# EAGLE schematic bmsmot (EAGLE 4.13)

## Sheet 1 of 2
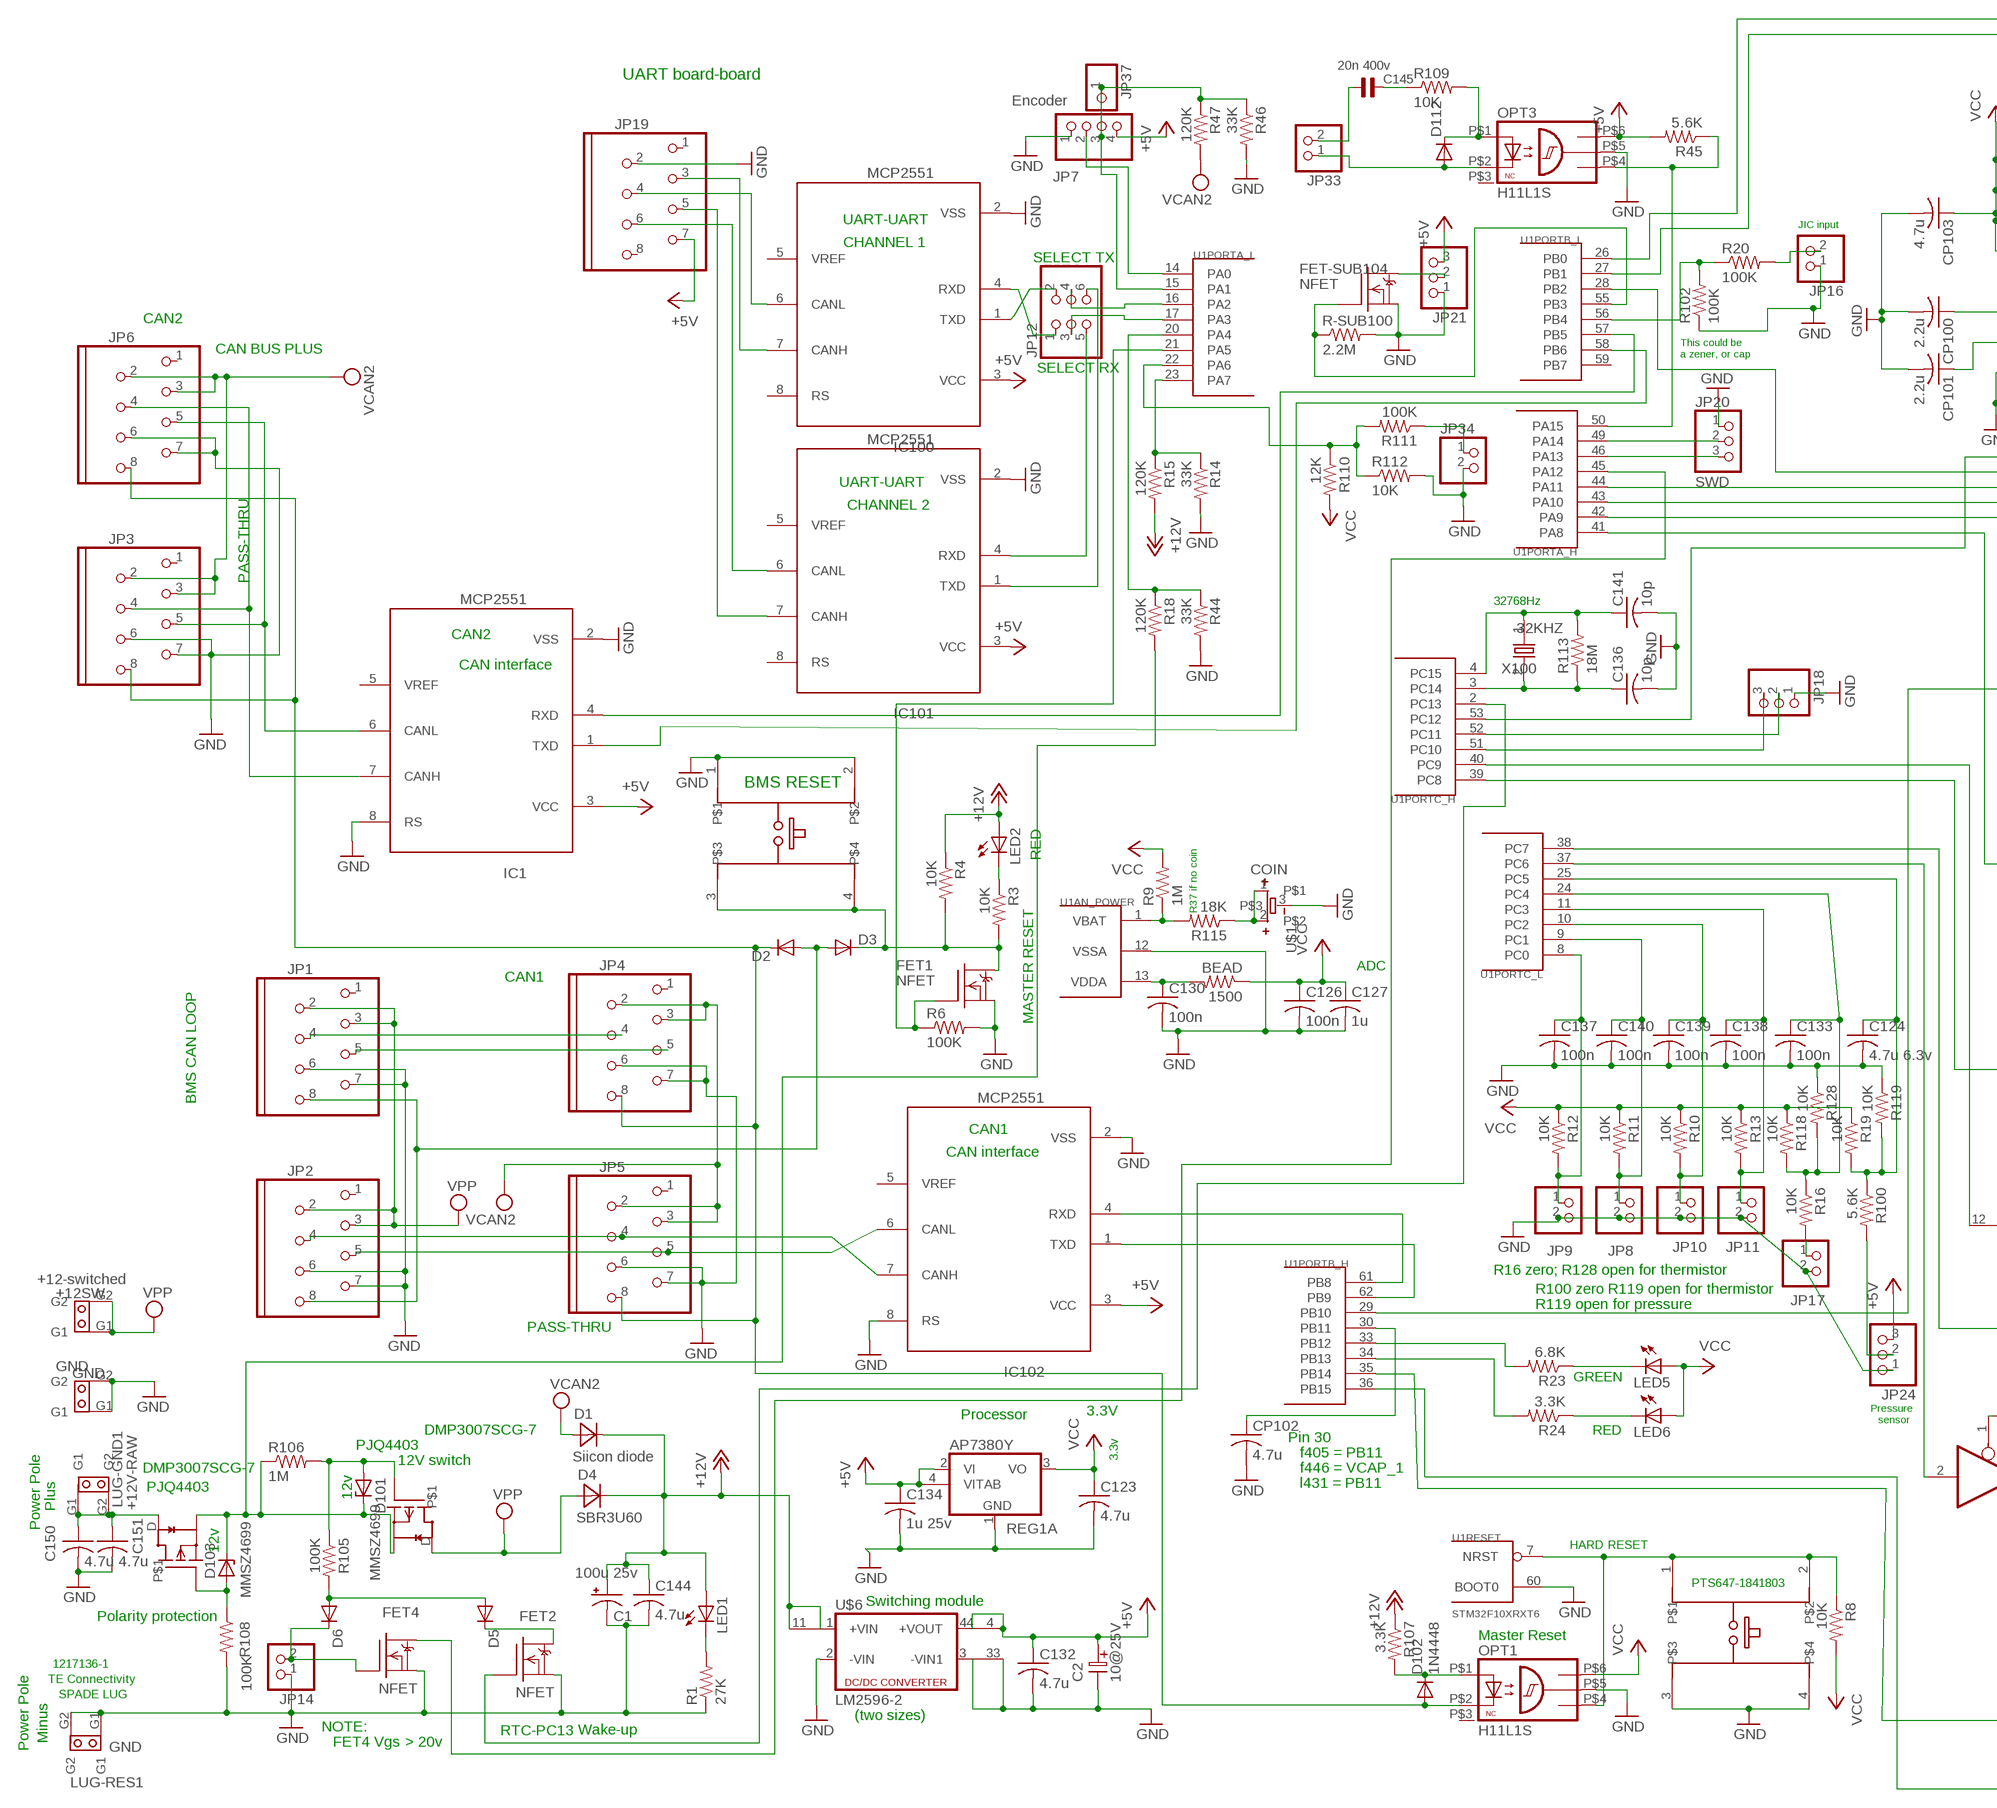
[diagram p0: schematic, sheet 1, part 1 of 2]
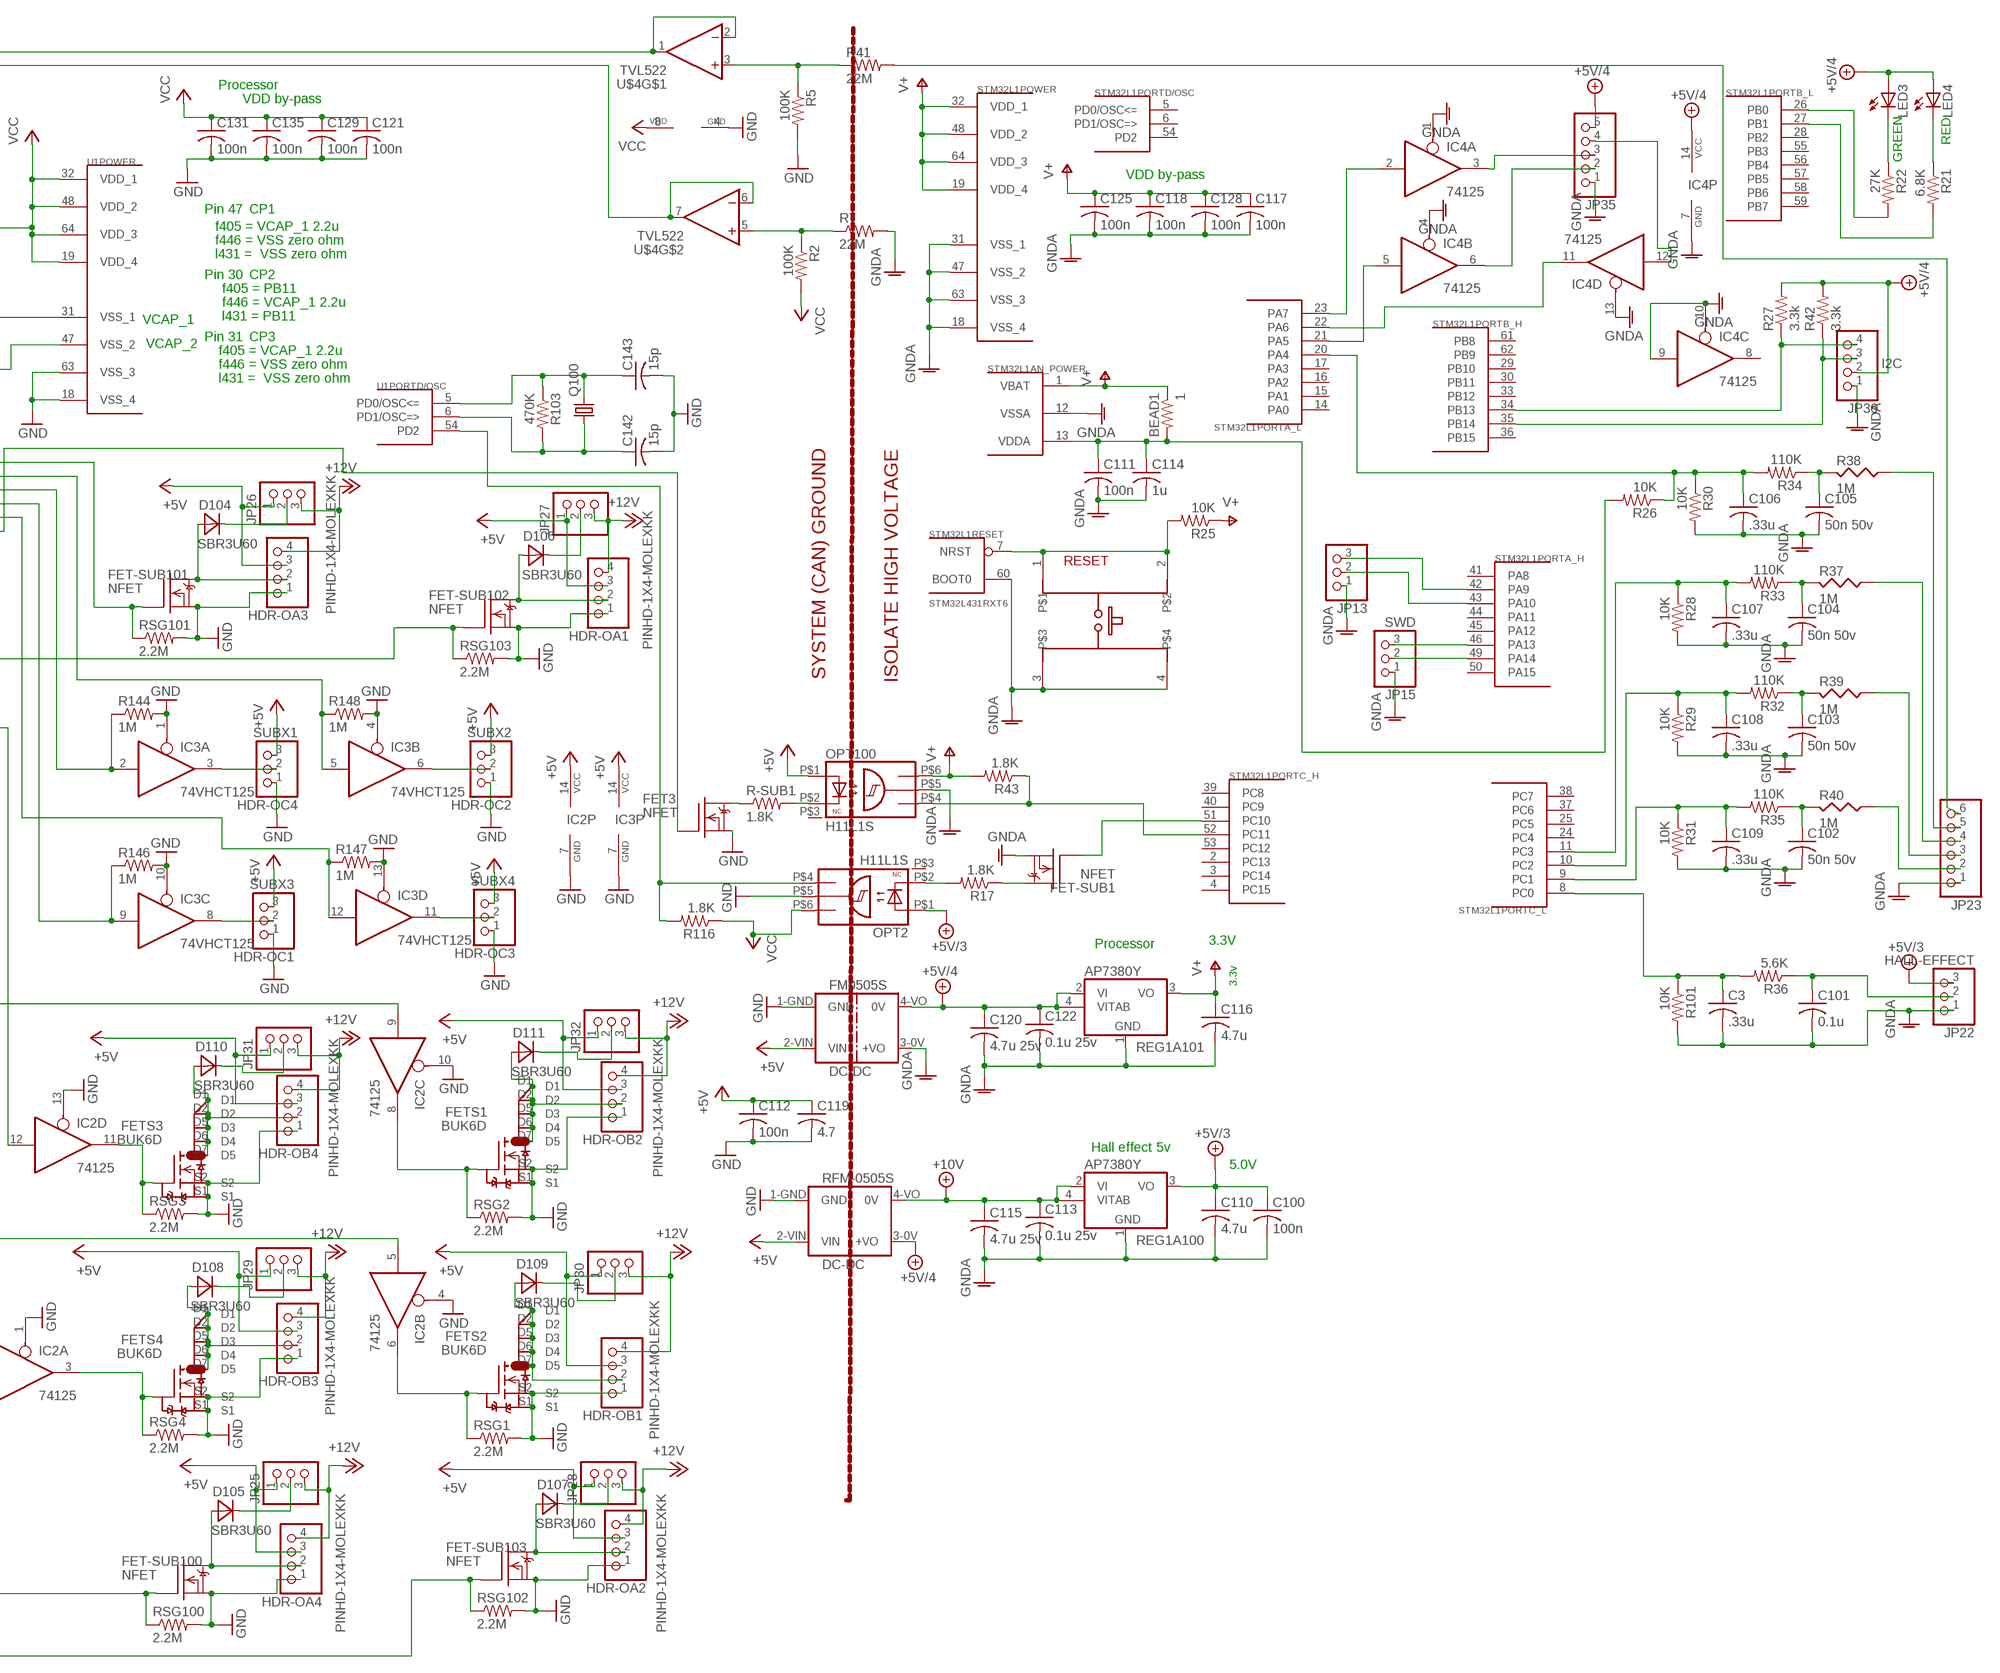
[diagram p1: schematic, sheet 1, part 2 of 2]

### Parts
32KHZ  X100  XTAL32KX32  [32KHZ]
+12SW  +12-switched  SPADE-TAB  [SPADE_TAB]
BEAD  1500  R-US_R0603  [R0603]
BEAD1  1  R-US_R0603  [R0603]
BMS-RESET  E-SWITCH2  [E-SWITCH2]
C1  100u 25v  CPOL-USE5-8.5  [E5-8,5]
C2  10@25V  ELC-2,5L  [ES-2,5L]
C3  .33u  C-USC0603  [C0603]
C100  100n  C-USC0603  [C0603]
C101  0.1u  C-USC0603  [C0603]
C102  50n 50v  C-USC0603  [C0603]
C103  50n 50v  C-USC0603  [C0603]
C104  50n 50v  C-USC0603  [C0603]
C105  50n 50v  C-USC0603  [C0603]
C106  .33u  C-USC0603  [C0603]
C107  .33u  C-USC0603  [C0603]
C108  .33u  C-USC0603  [C0603]
C109  .33u  C-USC0603  [C0603]
C110  4.7u  C-USC0603  [C0603]
C111  100n  C-USC0603  [C0603]
C112  100n  C-USC0603  [C0603]
C113  0.1u 25v  C-USC0603  [C0603]
C114  1u  C-USC0603  [C0603]
C115  4.7u 25v  C-USC0805  [C0805]
C116  4.7u  C-USC0603  [C0603]
C117  100n  C-USC0603  [C0603]
C118  100n  C-USC0603  [C0603]
C119  4.7  C-USC0805  [C0805]
C120  4.7u 25v  C-USC0805  [C0805]
C121  100n  C-USC0603  [C0603]
C122  0.1u 25v  C-USC0603  [C0603]
C123  4.7u  C-USC0603  [C0603]
C124  4.7u 6.3v  C-USC0603  [C0603]
C125  100n  C-USC0603  [C0603]
C126  100n  C-USC0603  [C0603]
C127  1u  C-USC0603  [C0603]
C128  100n  C-USC0603  [C0603]
C129  100n  C-USC0603  [C0603]
C130  100n  C-USC0603  [C0603]
C131  100n  C-USC0603  [C0603]
C132  4.7u  C-USC0603  [C0603]
C133  100n  C-USC0603  [C0603]
C134  1u 25v  C-USC0603  [C0603]
C135  100n  C-USC0603  [C0603]
C136  10p  C-USC0603  [C0603]
C137  100n  C-USC0603  [C0603]
C138  100n  C-USC0603  [C0603]
C139  100n  C-USC0603  [C0603]
C140  100n  C-USC0603  [C0603]
C141  10p  C-USC0603  [C0603]
C142  15p  C-USC0603  [C0603]
C143  15p  C-USC0603  [C0603]
C144  4.7u  C-USC0805  [C0805]
C145  20n 400v  C1210  [1210]
C150  4.7u  C-USC0805  [C0805]
C151  4.7u  C-USC0805  [C0805]
CP100  2.2u  C-USC0603  [C0603]
CP101  2.2u  C-USC0603  [C0603]
CP102  4.7u  C-USC0603  [C0603]
CP103  4.7u  C-USC0603  [C0603]
D1  Siicon diode  SBR3U60  [POWERDI123]
D2  DIODE-SOD323-R  [SOD323-R]
D3  DIODE-SOD323-R  [SOD323-R]
D4  SBR3U60  [POWERDI123]
D5  DIODE-SOD323-R  [SOD323-R]
D6  DIODE-SOD323-R  [SOD323-R]
D101  MMSZ4699  ZENER-DIODESOD80C  [SOD80C]
D102  1N4448  DIODE-SOD123  [SOD123]
D103  MMSZ4699  ZENER-DIODESOD80C  [SOD80C]
D104  SBR3U60  [POWERDI123]
D105  SBR3U60  [POWERDI123]
D106  SBR3U60  [POWERDI123]
D107  SBR3U60  [POWERDI123]
D108  SBR3U60  [POWERDI123]
D109  SBR3U60  [POWERDI123]
D110  SBR3U60  [POWERDI123]
D111  SBR3U60  [POWERDI123]
D112  DIODE-SOD323-R  [SOD323-R]
FET1  NFET  DMN3404L  [SOT-23]
FET2  NFET  DMN3404L  [SOT-23]
FET3  NFET  DMN3404L  [SOT-23]
FET4  NFET  DMN3404L  [SOT-23]
FET-SUB1  NFET  DMN3404L  [SOT-23]
FET-SUB100  NFET  DMN3404L  [SOT-23]
FET-SUB101  NFET  DMN3404L  [SOT-23]
FET-SUB102  NFET  DMN3404L  [SOT-23]
FET-SUB103  NFET  DMN3404L  [SOT-23]
FET-SUB104  NFET  DMN3404L  [SOT-23]
FETS1  BUK6D  [DFN2020-6]
FETS2  BUK6D  [DFN2020-6]
FETS3  BUK6D  [DFN2020-6]
FETS4  BUK6D  [DFN2020-6]
FM0505S  DC-DC  [DC-DC]
GND  GND  SPADE-TAB  [SPADE_TAB]
HDR-OA1  PINHD-1X4-MOLEXKK  [1X4-MOLEXKK]
HDR-OA2  PINHD-1X4-MOLEXKK  [1X4-MOLEXKK]
HDR-OA3  PINHD-1X4-MOLEXKK  [1X4-MOLEXKK]
HDR-OA4  PINHD-1X4-MOLEXKK  [1X4-MOLEXKK]
HDR-OB1  PINHD-1X4-MOLEXKK  [1X4-MOLEXKK]
HDR-OB2  PINHD-1X4-MOLEXKK  [1X4-MOLEXKK]
HDR-OB3  PINHD-1X4-MOLEXKK  [1X4-MOLEXKK]
HDR-OB4  PINHD-1X4-MOLEXKK  [1X4-MOLEXKK]
HDR-OC1  SUBX3  PINHD-1X3  [1X03]
HDR-OC2  SUBX2  PINHD-1X3  [1X03]
HDR-OC3  SUBX4  PINHD-1X3  [1X03]
HDR-OC4  SUBX1  PINHD-1X3  [1X03]
IC1  MCP2551  [SO-08]
IC2  74125  [TSSOP14]
IC3  74VHCT125  74125  [TSSOP14]
IC4  74125  [TSSOP14]
IC100  MCP2551  [SO-08]
IC101  MCP2551  [SO-08]
IC102  MCP2551  [SO-08]
JP1  MOD8P8C  [MOD8P8C]
JP2  MOD8P8C  [MOD8P8C]
JP3  MOD8P8C  [MOD8P8C]
JP4  MOD8P8C  [MOD8P8C]
JP5  MOD8P8C  [MOD8P8C]
JP6  MOD8P8C  [MOD8P8C]
JP7  Encoder  PINHD-1X4  [1X04]
JP8  PINHD-1X2  [1X02]
JP9  PINHD-1X2  [1X02]
JP10  PINHD-1X2  [1X02]
JP11  PINHD-1X2  [1X02]
JP12  PINHD-2X3  [2X03]
JP13  PINHD-1X3  [1X03]
JP14  PINHD-1X2  [1X02]
JP15  SWD  PINHD-1X3  [1X03]
JP16  PINHD-1X2  [1X02]
JP17  PINHD-1X2  [1X02]
JP18  PINHD-1X3  [1X03]
JP19  MOD8P8C  [MOD8P8C]
JP20  SWD  PINHD-1X3  [1X03]
JP21  PINHD-1X3  [1X03]
JP22  HALL-EFFECT  PINHD-1X3  [1X03]
JP23  PINHD-1X6  [1X06]
JP24  PINHD-1X3  [1X03]
JP25  PINHD-1X3  [1X03]
JP26  PINHD-1X3  [1X03]
JP27  PINHD-1X3  [1X03]
JP28  PINHD-1X3  [1X03]
JP29  PINHD-1X3  [1X03]
JP30  PINHD-1X3  [1X03]
JP31  PINHD-1X3  [1X03]
JP32  PINHD-1X3  [1X03]
JP33  PINHD-1X2  [1X02]
JP34  PINHD-1X2  [1X02]
JP35  PINHD-1X5  [1X05]
JP36  I2C  PINHD-1X4  [1X04]
JP37  PINHD-1X1  [1X01]
LED1  LEDCHIP-LED0603  [CHIP-LED0603]
LED2  LEDCHIP-LED0603  [CHIP-LED0603]
LED3  LEDCHIP-LED0603  [CHIP-LED0603]
LED4  LEDCHIP-LED0603  [CHIP-LED0603]
LED5  LEDCHIP-LED0603  [CHIP-LED0603]
LED6  LEDCHIP-LED0603  [CHIP-LED0603]
LUG-GND1  +12V-RAW  SPADE-TAB  [SPADE_TAB]
LUG-RES1  GND  SPADE-TAB  [SPADE_TAB]
OPT1  H11L1S  H!!LX  [SMD-6]
OPT2  H11L1S  H!!LX  [SMD-6]
OPT3  H11L1S  H!!LX  [SMD-6]
OPT100  H11L1S  H!!LX  [SMD-6]
Q100  CRYTALHC49S  [HC49/S]
R1  27K  R-US_R0603  [R0603]
R2  100K  R-US_R0603  [R0603]
R3  10K  R-US_R0603  [R0603]
R4  10K  R-US_R0603  [R0603]
R5  100K  R-US_R0603  [R0603]
R6  100K  R-US_R0603  [R0603]
R7  22M  R-US_0207/5V  [0207/5V]
R8  10K  R-US_R0603  [R0603]
R9  1M  R-US_R0603  [R0603]
R10  10K  R-US_R0603  [R0603]
R11  10K  R-US_R0603  [R0603]
R12  10K  R-US_R0603  [R0603]
R13  10K  R-US_R0603  [R0603]
R14  33K  R-US_R0603  [R0603]
R15  120K  R-US_R0603  [R0603]
R16  10K  R-US_R0603  [R0603]
R17  1.8K  R-US_R0603  [R0603]
R18  120K  R-US_R0603  [R0603]
R19  10K  R-US_R0603  [R0603]
R20  100K  R-US_R0603  [R0603]
R21  6.8K  R-US_R0603  [R0603]
R22  27K  R-US_R0603  [R0603]
R23  6.8K  R-US_R0603  [R0603]
R24  3.3K  R-US_R0603  [R0603]
R25  10K  R-US_R0603  [R0603]
R26  10K  R-US_R0603  [R0603]
R27  3.3k  R-US_R0603  [R0603]
R28  10K  R-US_R0603  [R0603]
R29  10K  R-US_R0603  [R0603]
R30  10K  R-US_R0603  [R0603]
R31  10K  R-US_R0603  [R0603]
R32  110K  R-US_R0603  [R0603]
R33  110K  R-US_R0603  [R0603]
R34  110K  R-US_R0603  [R0603]
R35  110K  R-US_R0603  [R0603]
R36  5.6K  R-US_R0603  [R0603]
R37  1M  RESUS-S2,5  [RS-2,5]
R38  1M  RESUS-S2,5  [RS-2,5]
R39  1M  RESUS-S2,5  [RS-2,5]
R40  1M  RESUS-S2,5  [RS-2,5]
R41  22M  R-US_0207/5V  [0207/5V]
R42  3.3k  R-US_R0603  [R0603]
R43  1.8K  R-US_R0603  [R0603]
R44  33K  R-US_R0603  [R0603]
R45  5.6K  R-US_R0603  [R0603]
R46  33K  R-US_R0603  [R0603]
R47  120K  R-US_R0603  [R0603]
R100  5.6K  R-US_R0603  [R0603]
R101  10K  R-US_R0603  [R0603]
R102  100K  R-US_R0603  [R0603]
R103  470K  R-US_R0603  [R0603]
R105  100K  R-US_R0603  [R0603]
R106  1M  R-US_R0603  [R0603]
R107  3.3K  R-US_R0603  [R0603]
R108  100K  R-US_R0603  [R0603]
R109  10K  R-US_R0603  [R0603]
R110  12K  R-US_R0603  [R0603]
R111  100K  R-US_R0603  [R0603]
R112  10K  R-US_R0603  [R0603]
R113  18M  R-US_R0603  [R0603]
R115  18K  R-US_R0603  [R0603]
R116  1.8K  R-US_R0603  [R0603]
R118  10K  R-US_R0603  [R0603]
R119  10K  R-US_R0603  [R0603]
R128  10K  R-US_R0603  [R0603]
R144  1M  R-US_R0402  [R0402]
R146  1M  R-US_R0402  [R0402]
R147  1M  R-US_R0402  [R0402]
R148  1M  R-US_R0402  [R0402]
R-SUB1  1.8K  R-US_R0603  [R0603]
R-SUB100  2.2M  R-US_R0603  [R0603]
REG1A  AP7380Y  [SOT89]
REG1A100  AP7380Y  [SOT89]
REG1A101  AP7380Y  [SOT89]
RESET  E-SWITCH2  [E-SWITCH2]
RESET1  E-SWITCH2  [E-SWITCH2]
RFM-0505S  DC-DC  [DC-DC]
RSG1  2.2M  R-US_R0603  [R0603]
RSG2  2.2M  R-US_R0603  [R0603]
RSG3  2.2M  R-US_R0603  [R0603]
RSG4  2.2M  R-US_R0603  [R0603]
RSG100  2.2M  R-US_R0603  [R0603]
RSG101  2.2M  R-US_R0603  [R0603]
RSG102  2.2M  R-US_R0603  [R0603]
RSG103  2.2M  R-US_R0603  [R0603]
STM32L1  STM32L431RXT6  STM32F10XRXT6  [TQFP64]
U1  STM32F10XRXT6  [TQFP64]
U$1  COIN  [COIN]
U$2  PJQ4403P  [DFN3333-8L]
U$3  PJQ4403P  [DFN3333-8L]
U$4  TVL522  [VSSOP8]
U$6  LM2596-2  [LM2569SW2]

### Nets
+5V: C2.1 C112.1 C119.1 C132.1 C134.1 FM0505S.2-VIN(VIN) HDR-OA1.3 HDR-OA2.3 HDR-OA3.3 HDR-OA4.3 HDR-OB1.3 HDR-OB2.3 HDR-OB3.3 HDR-OB4.3 HDR-OC1.3 HDR-OC2.3 HDR-OC3.3 HDR-OC4.3 IC1.3(VCC) IC2.14(P:VCC) IC3.14(P:VCC) IC100.3(VCC) IC101.3(VCC) IC102.3(VCC) JP7.4 JP19.7 JP21.3 JP24.3 JP25.1 JP26.1 JP27.1 JP28.1 JP29.1 JP30.1 JP31.1 JP32.1 OPT3.P$6(VCC) OPT100.P$1(A) R45.2 REG1A.2(VI) REG1A.4(VITAB) RFM-0505S.2-VIN(VIN) U$6.4(+VOUT1) U$6.44(+VOUT)
+5V/3: C100.1 C110.1 JP22.3 OPT2.P$1(A) REG1A100.3(VO)
+5V/4: C120.1 C122.1 FM0505S.4-VO(0V) IC4.14(P:VCC) JP35.5 JP36.2 LED3.A LED4.A R27.2 R42.2 REG1A101.2(VI) REG1A101.4(VITAB) RFM-0505S.3-0V(+VO)
+10V: C113.1 C115.1 REG1A100.2(VI) REG1A100.4(VITAB) RFM-0505S.4-VO(0V)
+12V: C1.+ C144.1 D1.C D4.C HDR-OA1.4 HDR-OA2.4 HDR-OA3.4 HDR-OA4.4 HDR-OB1.4 HDR-OB2.4 HDR-OB3.4 HDR-OB4.4 JP25.3 JP26.3 JP27.3 JP28.3 JP29.3 JP30.3 JP31.3 JP32.3 LED1.A LED2.A R4.1 R15.2 R107.1 U$6.1(+VIN) U$6.11(+VIN1)
+12V-POLARITY: D101.C D103.C R18.2 R106.1 U$2.S(S3) U$3.S(S3)
+12V-RAW: C150.1 C151.1 LUG-GND1.G1 LUG-GND1.G2 U$2.D
AC-12VRMS: JP34.1 R111.1
AC-OPTO-1: D112.A JP33.1 OPT3.P$2(C)
AC-OPTO-2: C145.1 JP33.2
AC-OPTO-IN: D112.C OPT3.P$1(A) R109.2
AC-OPTO-RC: C145.2 R109.1
BUFF1-PC8: IC2.9(C:I) U1.39(PORTC_H:PC8)
BUFF2-PC7: IC2.5(B:I) U1.38(PORTC_L:PC7)
BUFF5-PC9: IC2.12(D:I) U1.40(PORTC_H:PC9)
BUFF6-PC6: IC2.2(A:I) U1.37(PORTC_L:PC6)
CANH1: IC102.7(CANH) JP2.4 JP5.4
CANH1-FT: JP1.4 JP4.4
CANH2: IC1.7(CANH) JP3.4 JP6.4
CANL1: IC102.6(CANL) JP2.5 JP5.5
CANL1-FT: JP1.5 JP4.5
CANL2: IC1.6(CANL) JP3.5 JP6.5
CHAN1-RX: IC100.4(RXD) JP12.1
CHAN1-TX: IC100.1(TXD) JP12.2
CHAN1_CAN-L: IC100.6(CANL) JP19.4
CHAN2-RX: IC101.4(RXD) JP12.5
CHAN2-TX: IC101.1(TXD) JP12.6
CHAN2_CAN-H: IC101.7(CANH) JP19.5
CHAN2_CAN-L: IC101.6(CANL) JP19.6
CHAN-1_CAN-H: IC100.7(CANH) JP19.3
COIN+: R115.1 U$1.1 U$1.2
DRAIN-SUB1: D111.A FETS1.D1 FETS1.D2 FETS1.D5(D3) FETS1.D6(D4) FETS1.D7(D5) HDR-OB2.2
DRAIN-SUB2: D109.A FETS2.D1 FETS2.D2 FETS2.D5(D3) FETS2.D6(D4) FETS2.D7(D5) HDR-OB1.2
DRAIN-SUB5: D110.A FETS3.D1 FETS3.D2 FETS3.D5(D3) FETS3.D6(D4) FETS3.D7(D5) HDR-OB4.2
DRAIN-SUB6: D108.A FETS4.D1 FETS4.D2 FETS4.D5(D3) FETS4.D6(D4) FETS4.D7(D5) HDR-OB3.2
DRAIN-SUB13: D107.A FET-SUB103.3(D) HDR-OA2.2
DRAIN-SUB14: D106.A FET-SUB102.3(D) HDR-OA1.2
DRAIN-SUB17: D104.A FET-SUB101.3(D) HDR-OA3.2
DRAIN-SUB18: D105.A FET-SUB100.3(D) HDR-OA4.2
DSEL-OA1: D106.C JP27.2
DSEL-OA2: D107.C JP28.2
DSEL-OA3: D104.C JP26.2
DSEL-OA4: D105.C JP25.2
DSEL-OB1: D109.C JP30.2
DSEL-OB2: D111.C JP32.2
DSEL-OB3: D108.C JP29.2
DSEL-OB4: D110.C JP31.2
FET1-DRAIN-MASTER-RESET: BMS-RESET.3 BMS-RESET.4 D3.C FET1.3(D) R3.2 R4.2
FET2-DRAIN: D5.C FET2.3(D)
FET3-DRAIN-UART5-TX: FET3.3(D) R-SUB1.1
FET103-GATE: D103.A R108.1 U$2.G
FET-SUB9-DRAIN: FET-SUB104.3(D) JP21.2
GATE-SUB4-PB10: FET-SUB102.1(G) RSG103.1 U1.29(PORTB_H:PB10)
GATE-SUB7-PB2: FET-SUB101.1(G) RSG101.1 U1.28(PORTB_L:PB2)
GATE-SUBH3-PB15: FET-SUB103.1(G) RSG102.1 U1.36(PORTB_H:PB15)
GATE-SUBH8-PB14: FET-SUB100.1(G) RSG100.1 U1.35(PORTB_H:PB14)
GND: BMS-RESET.1 BMS-RESET.2 C1.- C2.2 C112.2 C119.2 C121.2 C123.2 C124.2 C126.2 C127.2 C129.2 C130.2 C131.2 C132.2 C133.2 C134.2 C135.2 C136.2 C137.2 C138.2 C139.2 C140.2 C141.2 C142.2 C143.2 C144.2 C150.2 C151.2 CP100.2 CP101.2 CP102.2 CP103.2 FET1.2(S) FET2.2(S) FET3.2(S) FET4.2(S) FET-SUB100.2(S) FET-SUB101.2(S) FET-SUB102.2(S) FET-SUB103.2(S) FET-SUB104.2(S) FETS1.S1 FETS1.S2 FETS2.S1 FETS2.S2 FETS3.S1 FETS3.S2 FETS4.S1 FETS4.S2 FM0505S.1-GND(GND) GND.G1 GND.G2 HDR-OA1.1 HDR-OA2.1 HDR-OA3.1 HDR-OA4.1 HDR-OB1.1 HDR-OB2.1 HDR-OB3.1 HDR-OB4.1 HDR-OC1.1 HDR-OC2.1 HDR-OC3.1 HDR-OC4.1 IC1.2(VSS) IC1.8(RS) IC2.1(A:OE) IC2.4(B:OE) IC2.7(P:GND) IC2.10(C:OE) IC2.13(D:OE) IC3.1(A:OE) IC3.4(B:OE) IC3.7(P:GND) IC3.10(C:OE) IC3.13(D:OE) IC100.2(VSS) IC101.2(VSS) IC102.2(VSS) IC102.8(RS) JP1.6 JP1.7 JP2.6 JP2.7 JP3.6 JP3.7 JP4.6 JP4.7 JP5.6 JP5.7 JP6.6 JP6.7 JP7.1 JP8.2 JP9.2 JP10.2 JP11.2 JP14.1 JP16.1 JP17.2 JP18.1 JP19.2 JP20.1 JP21.1 JP24.1 JP34.2 LUG-RES1.G1 LUG-RES1.G2 OPT1.P$5(GND) OPT2.P$5(GND) OPT3.P$5(GND) R1.1 R5.2 R6.2 R14.2 R44.2 R46.2 R102.1 R108.2 R112.2 R119.1 R128.1 R144.2 R146.2 R147.2 R148.2 R-SUB100.2 REG1A.1(GND) RESET.3 RESET.4 RFM-0505S.1-GND(GND) RSG1.2 RSG2.2 RSG3.2 RSG4.2 RSG100.2 RSG101.2 RSG102.2 RSG103.2 U1.12(AN_POWER:VSSA) U1.18(POWER:VSS_4) U1.60(RESET:BOOT0) U1.63(POWER:VSS_3) U$1.3 U$4.4(GND) U$6.2(-VIN) U$6.3(-VIN1) U$6.33(-VIN2)
GNDA: C3.2 C100.2 C101.2 C102.2 C103.2 C104.2 C105.2 C106.2 C107.2 C108.2 C109.2 C110.2 C111.2 C113.2 C114.2 C115.2 C116.2 C117.2 C118.2 C120.2 C122.2 C125.2 C128.2 FET-SUB1.2(S) FM0505S.3-0V(+VO) IC4.1(A:OE) IC4.4(B:OE) IC4.7(P:GND) IC4.9(C:I) IC4.10(C:OE) IC4.13(D:OE) JP13.1 JP15.1 JP22.1 JP23.1 JP35.1 JP36.1 OPT100.P$5(GND) R7.2 R28.2 R29.2 R30.2 R31.2 R101.2 REG1A100.1(GND) REG1A101.1(GND) RESET1.3 RESET1.4 STM32L1.12(AN_POWER:VSSA) STM32L1.18(POWER:VSS_4) STM32L1.31(POWER:VSS_1) STM32L1.47(POWER:VSS_2) STM32L1.60(RESET:BOOT0) STM32L1.63(POWER:VSS_3)
HDRXA1: HDR-OC1.2 IC3.8(C:O)
HDRXA2: HDR-OC2.2 IC3.6(B:O)
HDRXA3: HDR-OC3.2 IC3.11(D:O)
HDRXA4: HDR-OC4.2 IC3.3(A:O)
HV1: JP23.4 R37.1
HV1-1: C104.1 R33.1 R37.2
HV1-2: C103.1 R32.1 R39.2
HV1-3: C102.1 R35.1 R40.2
HV1-4: C105.1 R34.1 R38.2
HV2: JP23.3 R39.1
HV3: JP23.2 R40.1
HV-AC: JP23.5 R38.1
HV-HALL-SIGNAL: C101.1 JP22.2 R36.1
HV-PLUS: JP23.6 R41.2
HV_LEAK-: R2.1 R7.1 U$4.5(+IN)
HV_LEAK_DIV+: R5.1 R41.1 U$4.3(+IN)
JIC-INPUT: JP16.2 R20.2
JP17-PC4: JP17.1 R16.2
JP24-PC5: JP24.2 R100.2
L431-LED-GRN-CATHODE: LED3.C R22.1
L431-LED-RED-CATHODE: LED4.C R21.1
L431-PA13-SWDIO: JP15.3 STM32L1.46(PORTA_H:PA13)
L431-PA14-SWCLK: JP15.2 STM32L1.49(PORTA_H:PA14)
L431-PB0-LED-GRN: R22.2 STM32L1.26(PORTB_L:PB0)
L431-PB1-LED-RED: R21.2 STM32L1.27(PORTB_L:PB1)
L431-PC10-USART3-TX2: FET-SUB1.1(G) STM32L1.51(PORTC_H:PC10)
L431-PC11-USART3-RX: OPT100.P$4(OUT) R43.1 STM32L1.52(PORTC_H:PC11)
L431-UART-TX-FET: FET-SUB1.3(D) R17.1
L431-USART-TX-OPTO: OPT2.P$2(C) R17.2
L431-VDDA: BEAD1.2 C111.1 C114.1 R26.2 STM32L1.13(AN_POWER:VDDA)
L-I2C2-SDA: JP36.4 R27.1 STM32L1.34(PORTB_H:PB13)
L-PA5-SPI1-SCK: IC4.5(B:I) STM32L1.21(PORTA_L:PA5)
L-PA6-SPI1-MISO: IC4.11(D:O) STM32L1.22(PORTA_L:PA6)
L-PA7-SPI1-MOSI: IC4.2(A:I) STM32L1.23(PORTA_L:PA7)
L-PB14-I2C2-SDA: JP36.3 R42.1 STM32L1.35(PORTB_H:PB14)
L-SPI1-MISO: IC4.12(D:I) JP35.4
L-SPI1-MOSI: IC4.3(A:O) JP35.3
L-SPI1-SCK: IC4.6(B:O) JP35.2
LED-EXT-GRN-CATHODE: LED5.C R23.1
LED-EXT-RED-CATHODE: LED6.C R24.1
LED-EXT-RED-CATHODE2: LED2.C R3.1
LED_BUS_PWR: LED1.C R1.2
MASTER-RESET-RESISTOR: D102.C OPT1.P$1(A) R107.2
MASTER-RESET-SYS: D2.C D102.A JP3.8 JP4.8 JP5.8 JP6.8 OPT1.P$2(C)
MASTER_RESET1: D2.A D3.A JP1.8 JP2.8
N$1: D6.C FET4.1(G) JP14.2
NRST: OPT1.P$4(OUT) R8.1 RESET.1 RESET.2 U1.7(RESET:NRST)
NRST1: R25.2 RESET1.1 RESET1.2 STM32L1.7(RESET:NRST)
PA0-T2C1: JP7.2 U1.14(PORTA_L:PA0)
PA1-T2C2|SYS12V: JP7.3 JP37.1 R46.1 R47.1 U1.15(PORTA_L:PA1)
PA2-USART2-TX: JP12.4 U1.16(PORTA_L:PA2)
PA3-USART2-RX: JP12.3 U1.17(PORTA_L:PA3)
PA4-RSP12V_POLARITY: R18.1 R44.1 U1.20(PORTA_L:PA4)
PA5-MASTER-RESET: FET1.1(G) R6.1 U1.21(PORTA_L:PA5)
PA6: R110.1 R111.2 R112.1 U1.22(PORTA_L:PA6)
PA7-12V-PROTECT-DIVIDER: R14.1 R15.1 U1.23(PORTA_L:PA7)
PA8-HDRX3: IC3.12(D:I) R147.1 U1.41(PORTA_H:PA8)
PA9-HDRX1: IC3.9(C:I) R146.1 U1.42(PORTA_H:PA9)
PA9-USART1-TX: JP13.3 STM32L1.42(PORTA_H:PA9)
PA10-HDRX4: IC3.2(A:I) R144.1 U1.43(PORTA_H:PA10)
PA10-USART1-RX: JP13.2 STM32L1.43(PORTA_H:PA10)
PA11-HDRX2: IC3.5(B:I) R148.1 U1.44(PORTA_H:PA11)
PA12-KEYSW-SENSE: FET4.3(D) U1.45(PORTA_H:PA12)
PA13-SWDIO: JP20.3 U1.46(PORTA_H:PA13)
PA14-SWCLK: JP20.2 U1.49(PORTA_H:PA14)
PA15-OPTO-OUT: OPT3.P$4(OUT) R45.1 U1.50(PORTA_H:PA15)
PB0_HVLEAK+: U1.26(PORTB_L:PB0) U$4.1(OUT) U$4.2(-IN)
PB1-HV_LEAK-: U1.27(PORTB_L:PB1) U$4.6(-IN) U$4.7(OUT)
PB3-SUB9: FET-SUB104.1(G) R-SUB100.1 U1.55(PORTB_L:PB3)
PB4: R20.1 R102.2 U1.56(PORTB_L:PB4)
PB5-CAN2-RX: IC1.4(RXD) U1.57(PORTB_L:PB5)
PB6-CAN2-TX: IC1.1(TXD) U1.58(PORTB_L:PB6)
PB8-CAN1-RX: IC102.4(RXD) U1.61(PORTB_H:PB8)
PB9-CAN1-TX: IC102.1(TXD) U1.62(PORTB_H:PB9)
PB11-I2C2-SDA|VCAP1: CP102.1 U1.30(PORTB_H:PB11)
PB12-LED2-GREEN: R23.2 U1.33(PORTB_H:PB12)
PB13-LED3-RED: R24.2 U1.34(PORTB_H:PB13)
PC0-ADC1_IN1: C3.1 R36.2 R101.1 STM32L1.8(PORTC_L:PC0)
PC0-IN10: C137.1 JP9.1 R12.2 U1.8(PORTC_L:PC0)
PC1-ADC1_IN2: C109.1 R31.1 R35.2 STM32L1.9(PORTC_L:PC1)
PC1-IN11: C140.1 JP8.1 R11.2 U1.9(PORTC_L:PC1)
PC2-ADC1-IN3: C108.1 R29.1 R32.2 STM32L1.10(PORTC_L:PC2)
PC2-IN12: C139.1 JP10.1 R10.2 U1.10(PORTC_L:PC2)
PC3-ADC1-IN4: C107.1 R28.1 R33.2 STM32L1.11(PORTC_L:PC3)
PC3-IN13: C138.1 JP11.1 R13.2 U1.11(PORTC_L:PC3)
PC4-ADC1_IN9: C106.1 R26.1 R30.1 R34.2 STM32L1.20(PORTA_L:PA4)
PC4-IN14: C133.1 R16.1 R118.2 R128.2 U1.24(PORTC_L:PC4)
PC5-IN15: C124.1 R19.2 R100.1 R119.2 U1.25(PORTC_L:PC5)
PC10-USART3-TX: JP18.3 U1.51(PORTC_H:PC10)
PC11-USART3-RX: JP18.2 U1.52(PORTC_H:PC11)
PC12-UART5-TX: FET3.1(G) U1.53(PORTC_H:PC12)
PC13-NFET-GATE: FET2.1(G) U1.2(PORTC_H:PC13)
PC14_OSC32IN|XTAL: 32KHZ.2 C136.1 R113.1 U1.3(PORTC_H:PC14)
PC15-32OSC-OUT: 32KHZ.1 C141.1 R113.2 U1.4(PORTC_H:PC15)
PD0_OSC_IN_XTAL: C143.1 Q100.2 R103.1 U1.5(PORTD/OSC:PD0/OSC<=)
PD1_OSC_OUT: C142.1 Q100.1 R103.2 U1.6(PORTD/OSC:PD1/OSC=>)
PD2-UART5-RX: OPT2.P$4(OUT) R116.2 U1.54(PORTD/OSC:PD2)
PFET-SWITCH-GATE: D101.A R105.1 R106.2 U$3.G
PFET-SWITCH-OR: D5.A D6.A R105.2
SUBH1-FET-GATE: FETS1.G IC2.8(C:O) RSG2.1
SUBH2-FET-GATE: FETS2.G IC2.6(B:O) RSG1.1
SUBH5-FET-GATE: FETS3.G IC2.11(D:O) RSG3.1
SUBH6-FET-GATE: FETS4.G IC2.3(A:O) RSG4.1
UART5-TX: OPT100.P$2(C) R-SUB1.2
V+: BEAD1.1 C116.1 C117.1 C118.1 C125.1 C128.1 OPT100.P$6(VCC) R25.1 R43.2 REG1A101.3(VO) STM32L1.1(AN_POWER:VBAT) STM32L1.19(POWER:VDD_4) STM32L1.32(POWER:VDD_1) STM32L1.48(POWER:VDD_2) STM32L1.64(POWER:VDD_3)
VBAT: R9.1 R115.2 U1.1(AN_POWER:VBAT)
VCAN2: D1.A JP3.2 JP3.3 JP4.2 JP4.3 JP5.2 JP5.3 JP6.2 JP6.3 R47.2
VCC: BEAD.1 C121.1 C123.1 C126.1 C127.1 C129.1 C131.1 C135.1 CP103.1 LED5.A LED6.A OPT1.P$6(VCC) OPT2.P$6(VCC) R2.2 R8.2 R9.2 R10.1 R11.1 R12.1 R13.1 R19.1 R110.2 R116.1 R118.1 REG1A.3(VO) U1.19(POWER:VDD_4) U1.32(POWER:VDD_1) U1.48(POWER:VDD_2) U1.64(POWER:VDD_3) U$4.8(VDD)
VDDA1: BEAD.2 C130.1 U1.13(AN_POWER:VDDA)
VPP: +12SW.G1 +12SW.G2 D4.A JP1.2 JP1.3 JP2.2 JP2.3 U$3.D
VSS_1-VCAP_1: CP100.1 U1.31(POWER:VSS_1)
VSS_3: CP101.1 U1.47(POWER:VSS_2)
Unconnected: IC1.5(VREF) IC4.8(C:O) IC100.5(VREF) IC100.8(RS) IC101.5(VREF) IC101.8(RS) IC102.5(VREF) JP1.1 JP2.1 JP3.1 JP4.1 JP5.1 JP6.1 JP19.1 JP19.8 OPT1.P$3(NC) OPT2.P$3(NC) OPT3.P$3(NC) OPT100.P$3(NC) STM32L1.2(PORTC_H:PC13) STM32L1.3(PORTC_H:PC14) STM32L1.4(PORTC_H:PC15) STM32L1.5(PORTD/OSC:PD0/OSC<=) STM32L1.6(PORTD/OSC:PD1/OSC=>) STM32L1.14(PORTA_L:PA0) STM32L1.15(PORTA_L:PA1) STM32L1.16(PORTA_L:PA2) STM32L1.17(PORTA_L:PA3) STM32L1.24(PORTC_L:PC4) STM32L1.25(PORTC_L:PC5) STM32L1.28(PORTB_L:PB2) STM32L1.29(PORTB_H:PB10) STM32L1.30(PORTB_H:PB11) STM32L1.33(PORTB_H:PB12) STM32L1.36(PORTB_H:PB15) STM32L1.37(PORTC_L:PC6) STM32L1.38(PORTC_L:PC7) STM32L1.39(PORTC_H:PC8) STM32L1.40(PORTC_H:PC9) STM32L1.41(PORTA_H:PA8) STM32L1.44(PORTA_H:PA11) STM32L1.45(PORTA_H:PA12) STM32L1.50(PORTA_H:PA15) STM32L1.53(PORTC_H:PC12) STM32L1.54(PORTD/OSC:PD2) STM32L1.55(PORTB_L:PB3) STM32L1.56(PORTB_L:PB4) STM32L1.57(PORTB_L:PB5) STM32L1.58(PORTB_L:PB6) STM32L1.59(PORTB_L:PB7) STM32L1.61(PORTB_H:PB8) STM32L1.62(PORTB_H:PB9) U1.59(PORTB_L:PB7)

### Notes on the sheet
- Processor
- UART board-board | VDD by-pass
- RED
- GREEN
- VDD by-pass
- Pin 47 | CP1
- f405 = VCAP_1 2.2u
- UART-UART
- JIC input
- f446 = VSS zero ohm
- CHANNEL 1 | l431 =  VSS zero ohm
- SELECT TX
- Pin 30 | CP2
- f405 = PB11
- f446 = VCAP_1 2.2u
- VCAP_1 | l431 = PB11
- CAN2
- Pin 31 | CP3
- This could be | VCAP_2
- CAN BUS PLUS | f405 = VCAP_1 2.2u
- a zener, or cap
- SELECT RX | f446 = VSS zero ohm
- l431 =  VSS zero ohm
- UART-UART
- PASS-THRU
- CHANNEL 2
- RESET
- 32768Hz
- CAN2
- CAN interface
- SYSTEM (CAN) GROUND | ISOLATE HIGH VOLTAGE
- BMS RESET
- RED
- R37 if no coin
- ADC
- CAN1
- Processor | 3.3V
- MASTER RESET
- 3.3v
- BMS CAN LOOP
- CAN1
- CAN interface
- Hall effect 5v
- 5.0V
- R16 zero; R128 open for thermistor
- R100 zero R119 open for thermistor
- R119 open for pressure
- PASS-THRU
- GREEN
- Pressure
- Processor | 3.3V
- sensor
- DMP3007SCG-7 | RED
- 3.3v
- Pin 30
- PJQ4403
- f405 = PB11
- 12V switch
- DMP3007SCG-7 | f446 = VCAP_1
- PJQ4403 | l431 = PB11
- 12v
- Plus
- Power Pole
- HARD | RESET
- 12v
- PTS647-1841803
- Switching module
- Polarity protection
- Master Reset
- 1217136-1
- TE Connectivity
- SPADE LUG
- Wake-up | (two sizes)
- NOTE: | RTC-PC13
- Minus | FET4 Vgs | > 20v
- Power Pole

## Sheet 2 of 2

## Library data of the parts
32KHZ = crystal:XTAL32K
+12SW GND LUG-GND1 LUG-RES1 = DEH:SPADE-TAB
BEAD BEAD1 R1-R36 R41-R47 R100-R103 R105-R113 R115 R116 R118 R119 R128 R144 R146-R148 R-SUB1 R-SUB100 RSG1-RSG4 RSG100-RSG103 = rcl:R-US_: RESISTOR, American symbol
BMS-RESET RESET RESET1 = switch-misc:E-SWITCH2
C1 = rcl:CPOL-US: POLARIZED CAPACITOR, American symbol
C2 = DEH:ELC-2,5L
C3 C100-C144 C150 C151 CP100-CP103 = rcl:C-US: CAPACITOR, American symbol
C145 = capsmd:C1210
D1 D4 D104-D111 = diode-1:SBR3U60
D2 D3 D5 D6 D102 D112 = diode:DIODE-: DIODE
D101 D103 = diode-1:ZENER-DIODE: Z-Diode
FET1-FET4 FET-SUB1 FET-SUB100-FET-SUB104 = transistor-fet:DMN3404L
FETS1-FETS4 = transistor-fet:BUK6D
FM0505S RFM-0505S = DEH:DC-DC
HDR-OA1-HDR-OA4 HDR-OB1-HDR-OB4 = pinhead:PINHD-1X4-MOLEXKK
HDR-OC1-HDR-OC4 JP13 JP15 JP18 JP20-JP22 JP24-JP32 = pinhead:PINHD-1X3: PIN HEADER
IC1 IC100-IC102 = texas:MCP2551
IC2-IC4 = 74xx-us:74*125: Quad bus BUFFER, 3-state
JP1-JP6 JP19 = DEH:MOD8P8C
JP7 JP36 = pinhead:PINHD-1X4: PIN HEADER
JP8-JP11 JP14 JP16 JP17 JP33 JP34 = pinhead:PINHD-1X2: PIN HEADER
JP12 = pinhead:PINHD-2X3: PIN HEADER
JP23 = pinhead:PINHD-1X6: PIN HEADER
JP35 = pinhead:PINHD-1X5: PIN HEADER
JP37 = pinhead:PINHD-1X1: PIN HEADER
LED1-LED6 = led:LED: LED OSRAM: - CHIPLED LG R971, LG N971, LY N971, LG Q971, LY Q971, LO R971, LY R971 LH N974, LH R974 LS Q976, LO Q976, LY Q976 LO Q996 - Hyper CHIPLED LW Q18S LB Q993, LB Q99A, LB R99A - SideLED LS A670, LO A670, LY A670, LG A670, LP A670 LB A673, LV A673, LT A673, LW A673 LH A674 LY A675 LS A676, LA A676, LO A676, LY A676, LW A676 LS A679, LY A679, LG A679 - Hyper Micro SIDELED® LS Y876, LA Y876, LO Y876, LY Y876 LT Y87S - SmartLED LW L88C, LW L88S LB L89C, LB L89S, LG L890 LS L89K, LO L89K, LY L89K LS L896, LA L896, LO L896, LY L896 - TOPLED LS T670, LO T670, LY T670, LG T670, LP T670 LSG T670, LSP T670, LSY T670, LOP T670, LYG T670 LG T671, LOG T671, LSG T671 LB T673, LV T673, LT T673, LW T673 LH T674 LS T676, LA T676, LO T676, LY T676, LB T676, LH T676, LSB T676, LW T676 LB T67C, LV T67C, LT T67C, LS T67K, LO T67K, LY T67K, LW E67C LS E67B, LA E67B, LO E67B, LY E67B, LB E67C, LV E67C, LT E67C LW T67C LS T679, LY T679, LG T679 LS T770, LO T770, LY T770, LG T770, LP T770 LB T773, LV T773, LT T773, LW T773 LH T774 LS E675, LA E675, LY E675, LS T675 LS T776, LA T776, LO T776, LY T776, LB T776 LHGB T686 LT T68C, LB T68C - Hyper Mini TOPLED® LB M676 - Mini TOPLED Santana® LG M470 LS M47K, LO M47K, LY M47K Source: http://www.osram.convergy.de/
OPT1-OPT3 OPT100 = optocoupler:H!!LX
Q100 = crystal:CRYTAL: CRYSTAL
R37-R40 = DEH:RESUS-S2,5
REG1A REG1A100 REG1A101 = linear:AP7380Y
STM32L1 U1 = stm32:STM32F10XRXT6: STM32F101/103 64pin LQFP
U$1 = DEH:COIN
U$2 U$3 = transistor-fet:PJQ4403P
U$4 = op-amp:TVL522
U$6 = dc-dc-converter:LM2596-2